# EAGLE design Ver3 (EAGLE 4.16)
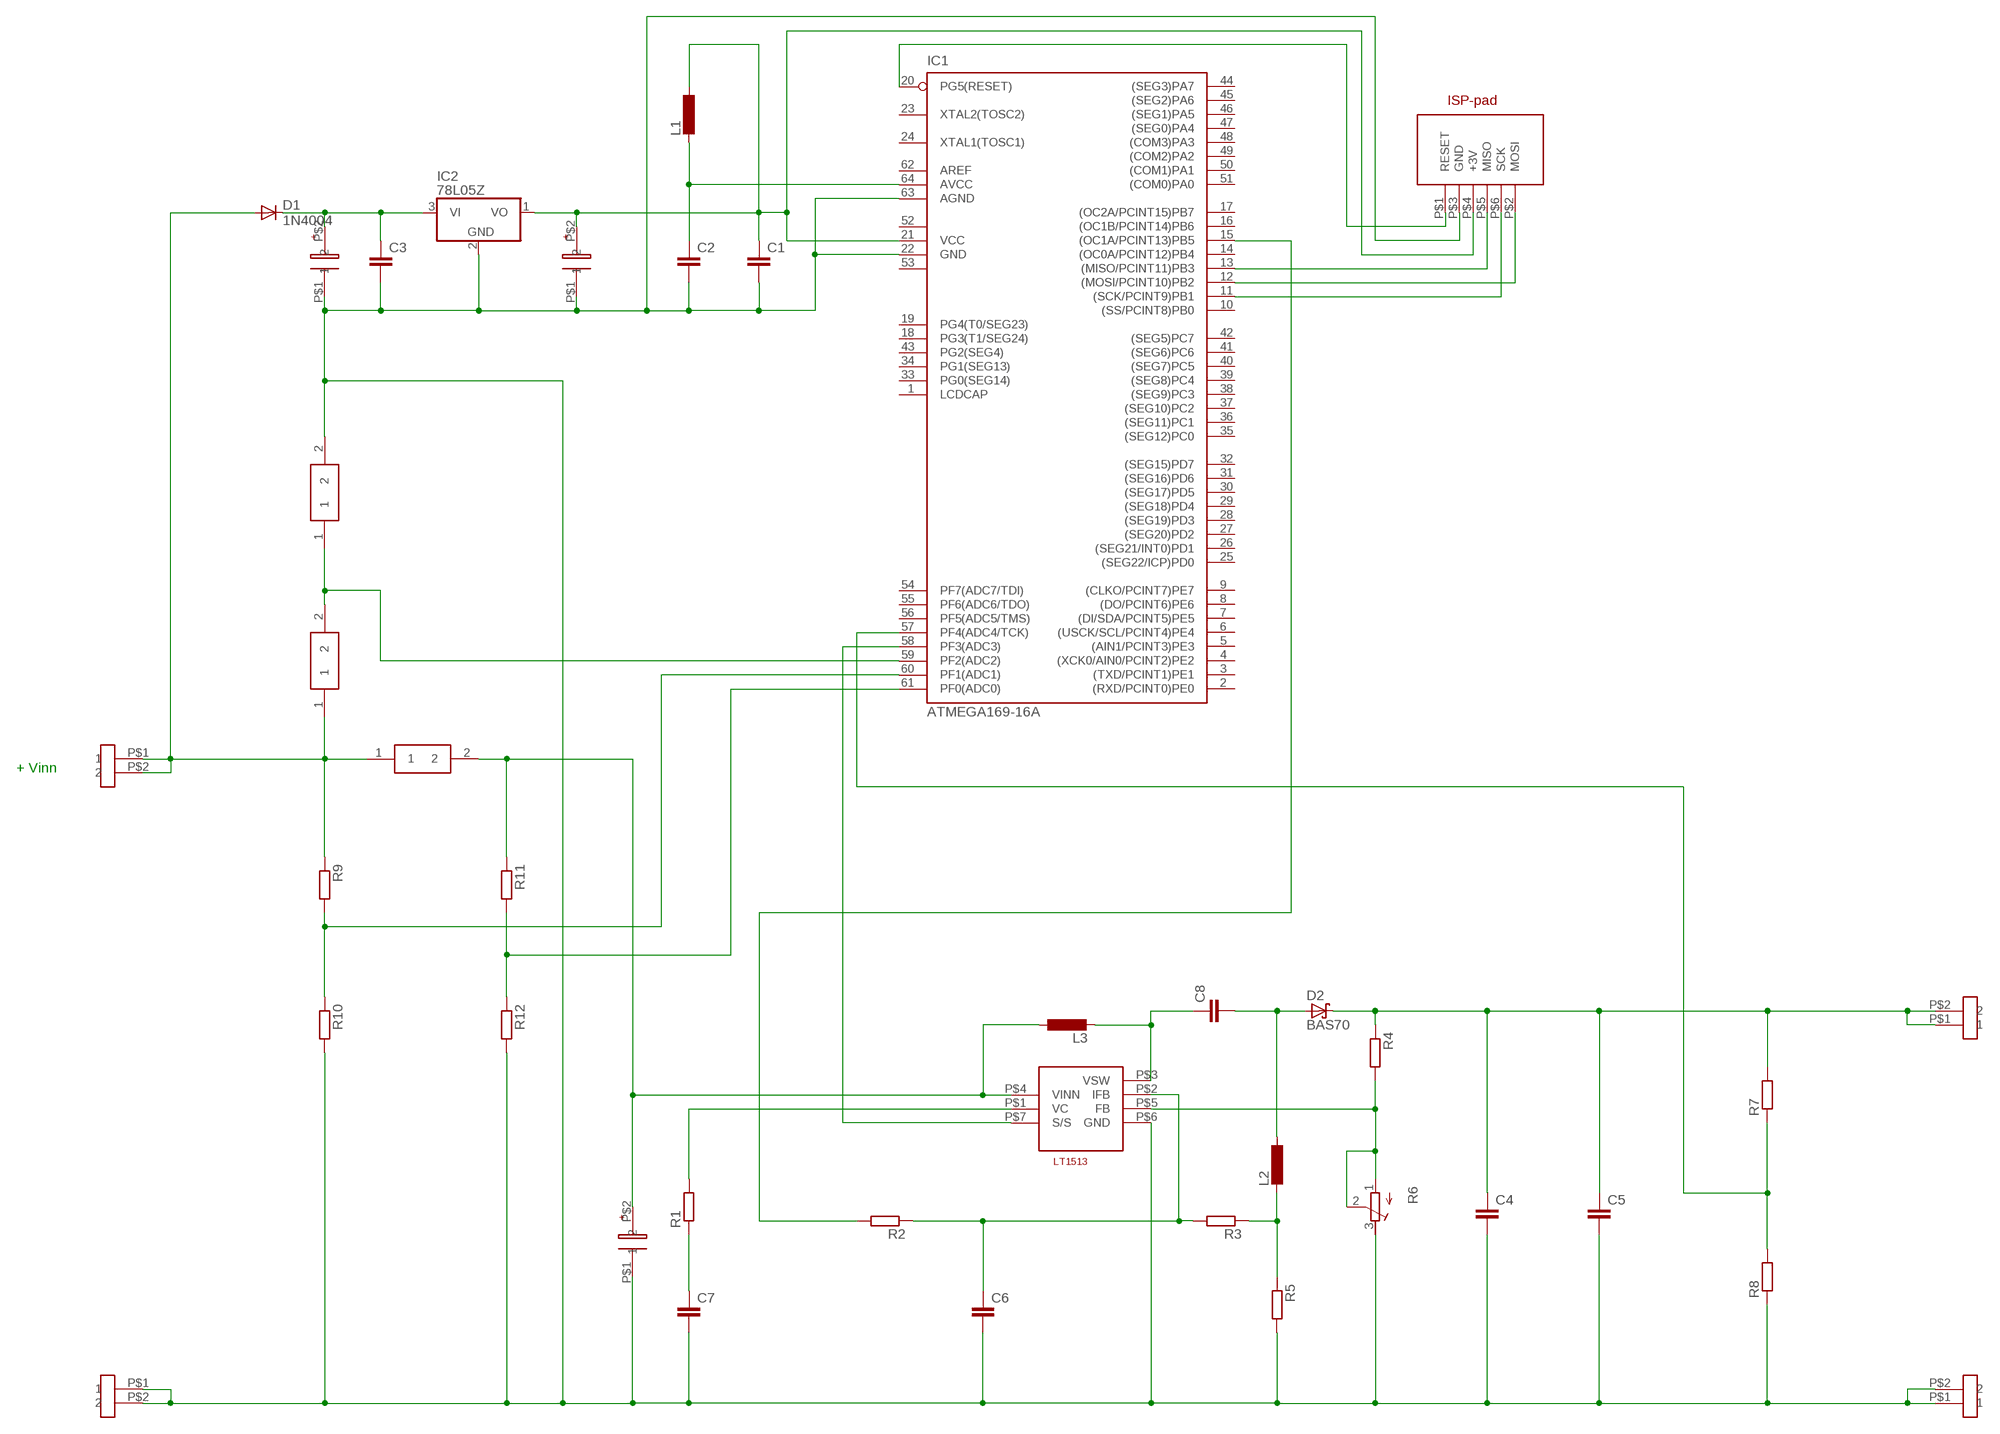
[diagram p0: schematic, sheet 1]

## Parts
68K1  MOTSTAND_OM  [MOTSTAND_OM]
68K2  MOTSTAND_OM  [MOTSTAND_OM]
68K3  MOTSTAND_OM  [MOTSTAND_OM]
100N1  CAP_OM  [CAP]
100N2  CAP_OM  [CAP]
100N3  CAP_OM  [CAP]
C1  C-EUC0603  [C0603]
C2  C-EUC0603  [C0603]
C3  C-EUC0603  [C0603]
C4  C-EUC0603  [C0603]
C5  C-EUC0603  [C0603]
C6  C-EUC0603  [C0603]
C7  C-EUC0603  [C0603]
C8  C-EUC0603  [C0603]
D1  1N4004  [DO41-10]
D2  BAS70  [SOT23]
IC1  ATMEGA169-16A  [TQFP64]
IC2  78L05Z  [TO92]
L1  L-EUL1812  [L1812]
L2  L-EU0204/7  [0204/7]
L3  L-EU0204/7  [0204/7]
R1  R-EU_R0603  [R0603]
R2  R-EU_R0603  [R0603]
R3  R-EU_R0603  [R0603]
R4  R-EU_R0603  [R0603]
R5  R-EU_R0603  [R0603]
R6  R-TRIMM4G/J  [RTRIM4G/J]
R7  R-EU_R0603  [R0603]
R8  R-EU_R0603  [R0603]
R9  R-EU_R0603  [R0603]
R10  R-EU_R0603  [R0603]
R11  R-EU_R0603  [R0603]
R12  R-EU_R0603  [R0603]
U$1  SKRUSTIFT_OM  [SKRUSTIFT]
U$2  LT1513  [LT1513]
U$3  SKRUSTIFT_OM  [SKRUSTIFT]
U$4  SKRUSTIFT_OM  [SKRUSTIFT]
U$5  SKRUSTIFT_OM  [SKRUSTIFT]
U$6  ISP_PAD_OM  [ISP_PAD]

## Nets
N$1: C2.1 IC1.64(AVCC) L1.2
N$2: 100N2.P$2 C1.1 IC1.21(VCC) IC2.1(VO) L1.1 U$6.P$4(+3V)
N$3: 68K3.2 100N1.P$1 100N2.P$1 100N3.P$1 C1.2 C2.2 C3.2 C4.2 C5.2 C6.2 C7.2 IC1.22(GND) IC1.63(AGND) IC2.2(GND) R5.2 R6.3(A) R8.1 R10.2 R12.2 U$2.P$6(GND) U$3.P$1 U$3.P$2 U$5.P$1 U$5.P$2 U$6.P$3(GND)
N$4: 100N1.P$2 C3.1 D1.C IC2.3(VI)
N$5: 68K1.1 68K2.1 D1.A R9.1 U$1.P$1 U$1.P$2
N$6: IC1.13((MISO/PCINT11)PB3) U$6.P$5(MISO)
N$7: 68K2.2 68K3.1 IC1.59(PF2(ADC2))
N$8: R1.2 U$2.P$1(VC)
N$9: IC1.12((MOSI/PCINT10)PB2) U$6.P$2(MOSI)
N$10: L2.2 R3.1 R5.1
N$11: IC1.15((OC1A/PCINT13)PB5) R2.2
N$12: C7.1 R1.1
N$13: C8.1 L3.2 U$2.P$3(VSW)
N$14: C4.1 C5.1 D2.3(C) R4.1 R7.2 U$4.P$1 U$4.P$2
N$15: R4.2 R6.1(E) R6.2(S) U$2.P$5(FB)
N$16: IC1.60(PF1(ADC1)) R9.2 R10.1
N$17: C8.2 D2.1(A) L2.1
N$18: C6.1 R2.1 R3.2 U$2.P$2(IFB)
N$19: IC1.58(PF3(ADC3)) U$2.P$7(S/S)
N$20: IC1.61(PF0(ADC0)) R11.2 R12.1
N$21: IC1.57(PF4(ADC4/TCK)) R7.1 R8.2
N$22: 68K1.2 100N3.P$2 L3.1 R11.1 U$2.P$4(VINN)
N$23: IC1.11((SCK/PCINT9)PB1) U$6.P$6(SCK)
N$25: IC1.20(PG5(RESET)) U$6.P$1(RESET)
Unconnected: IC1.1(LCDCAP) IC1.2((RXD/PCINT0)PE0) IC1.3((TXD/PCINT1)PE1) IC1.4((XCK0/AIN0/PCINT2)PE2) IC1.5((AIN1/PCINT3)PE3) IC1.6((USCK/SCL/PCINT4)PE4) IC1.7((DI/SDA/PCINT5)PE5) IC1.8((DO/PCINT6)PE6) IC1.9((CLKO/PCINT7)PE7) IC1.10((SS/PCINT8)PB0) IC1.14((OC0A/PCINT12)PB4) IC1.16((OC1B/PCINT14)PB6) IC1.17((OC2A/PCINT15)PB7) IC1.18(PG3(T1/SEG24)) IC1.19(PG4(T0/SEG23)) IC1.23(XTAL2(TOSC2)) IC1.24(XTAL1(TOSC1)) IC1.25((SEG22/ICP)PD0) IC1.26((SEG21/INT0)PD1) IC1.27((SEG20)PD2) IC1.28((SEG19)PD3) IC1.29((SEG18)PD4) IC1.30((SEG17)PD5) IC1.31((SEG16)PD6) IC1.32((SEG15)PD7) IC1.33(PG0(SEG14)) IC1.34(PG1(SEG13)) IC1.35((SEG12)PC0) IC1.36((SEG11)PC1) IC1.37((SEG10)PC2) IC1.38((SEG9)PC3) IC1.39((SEG8)PC4) IC1.40((SEG7)PC5) IC1.41((SEG6)PC6) IC1.42((SEG5)PC7) IC1.43(PG2(SEG4)) IC1.44((SEG3)PA7) IC1.45((SEG2)PA6) IC1.46((SEG1)PA5) IC1.47((SEG0)PA4) IC1.48((COM3)PA3) IC1.49((COM2)PA2) IC1.50((COM1)PA1) IC1.51((COM0)PA0) IC1.54(PF7(ADC7/TDI)) IC1.55(PF6(ADC6/TDO)) IC1.56(PF5(ADC5/TMS)) IC1.62(AREF)

## Notes on the sheet
- + Vinn

## Power pins joined to a net without a drawn wire
GND1: IC1.53(GND1)
VCC1: IC1.52(VCC1)

## Library data of the parts
68K1-68K3 = EGNE:MOTSTAND_OM
100N1-100N3 = EGNE:CAP_OM
C1-C8 = rcl:C-EU: CAPACITOR, European symbol
D1 = diode:1N4004: DIODE general purpose rectifier, 1 A
D2 = diode:BAS70: Silicon Schottky Diodes General-purpose diode for high-speed switching
IC1 = avr:ATMEGA169: MICROCONTROLLER 16 Kbytes FLASH 1 Kbytes SRAM 512 bytes EEPROM USART 8-channel 10 bit ADC 4x25 Segment LCD Driver
IC2 = linear:78*: Positive VOLTAGE REGULATOR Source: http://cache.national.com/ds/LM/LM78L05.pdf http://www.fairchildsemi.com/ds/LM/LM7805.pdf
L1-L3 = rcl:L-EU: INDUCTOR, European symbol
R1-R5 R7-R12 = rcl:R-EU_: RESISTOR, European symbol
R6 = rcl:R-TRIMM: Trimm resistor
U$1 U$3-U$5 = EGNE:SKRUSTIFT_OM
U$2 = EGNE:LT1513
U$6 = EGNE:ISP_PAD_OM

## Board
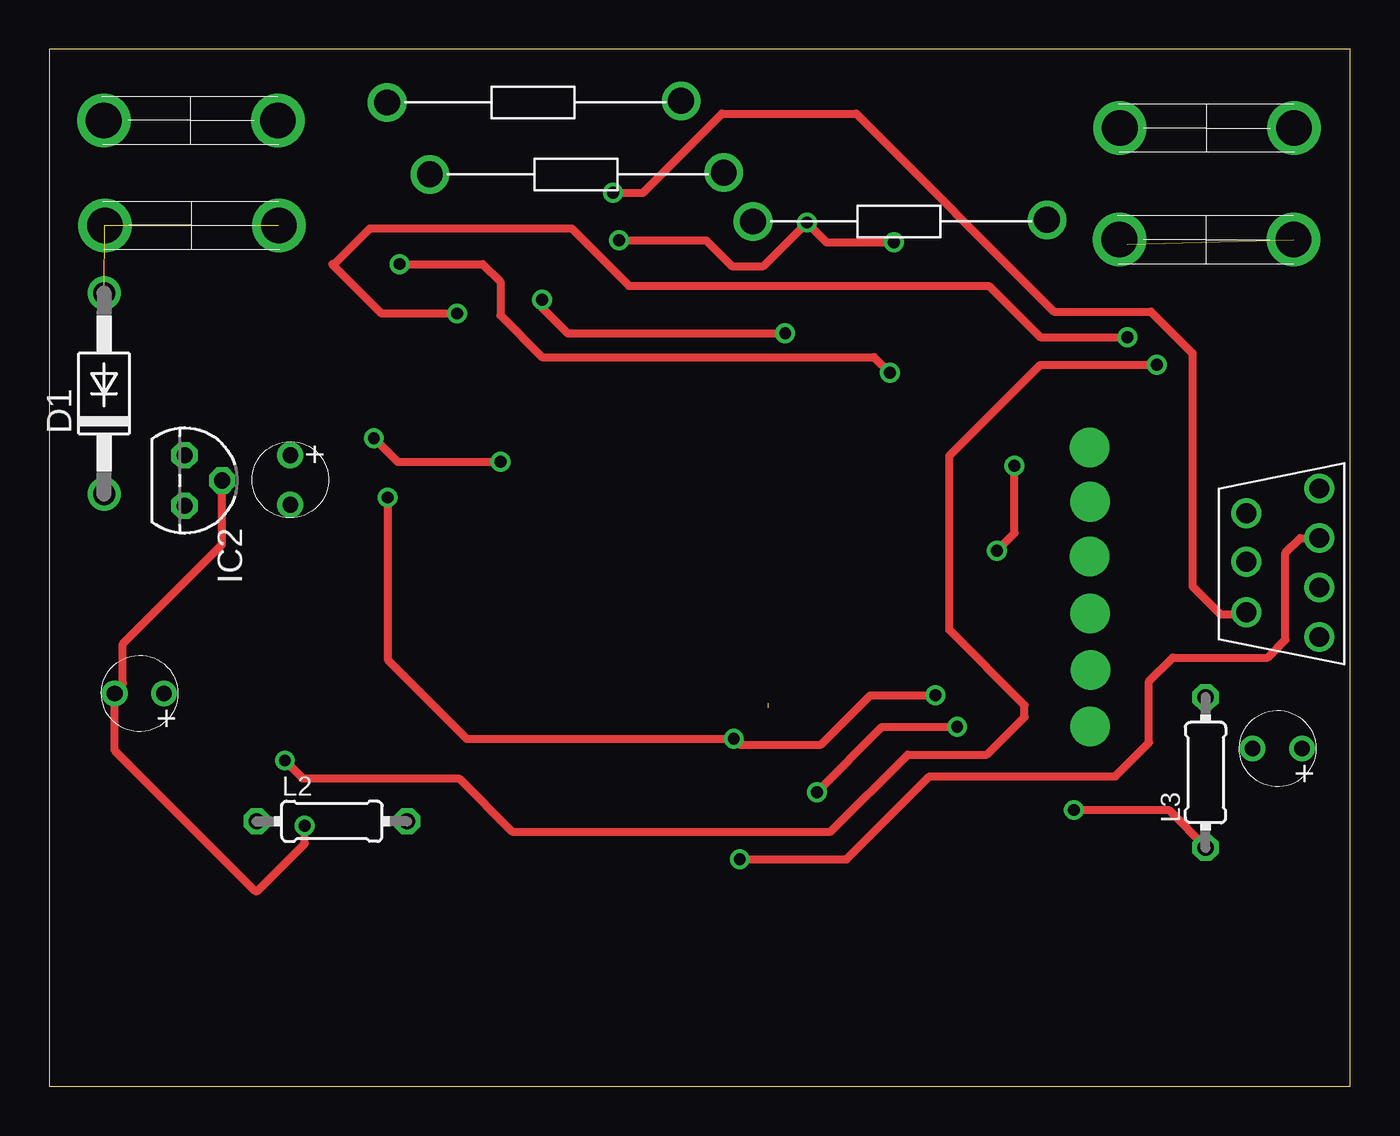
[diagram p1: board, top side]
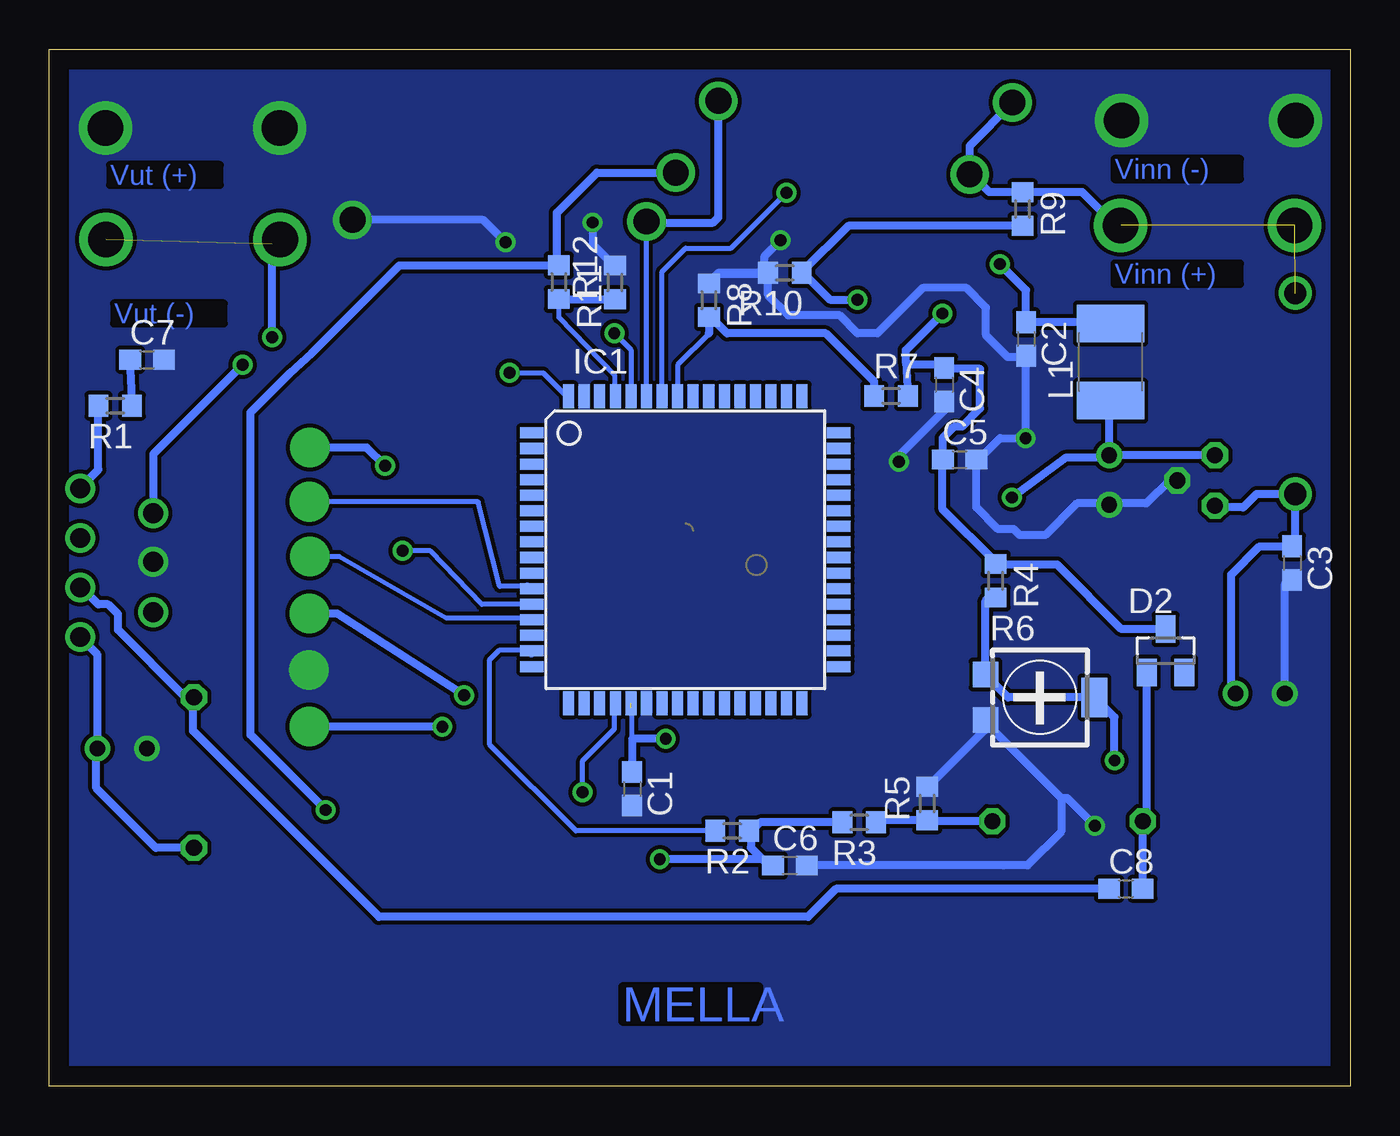
[diagram p2: board, bottom side, seen from below]

Size 65.78 x 52.41 mm. Coordinates in mm from the lower left corner, seen from the top.
Outline: 0,0 65.78,0 65.78,52.41 0,52.41 0,0
Copper layers (1*16): Top 0.035mm / dielectric 1.5mm / Bottom 0.035mm
Design rules "default": minimum track width 10mil, minimum drill 24mil, track to track 8mil, track to pad 8mil, pad to pad 8mil, via to via 8mil, smd to smd 8mil, copper to edge 40mil, drill to drill 8mil, minimum pad ring 10mil, minimum via ring 8mil, stop-mask expansion 4mil, vias tented up to drill 0mil, thermal gap 10mil

### Footprints (pad centres in the part's own frame; a part is rotated, then mirrored left to right if it is on the bottom)
MOTSTAND_OM = drill 1.3 round: 1 0,0; 2 -0.084,14.868
CAP = drill 0.8 round: P$1 0,0; P$2 0,2.5
C0603 = smd 1.1 x 1: 1 -0.85,0; 2 0.85,0
DO41-10 = drill 1.118 round: A 5.08,0; C -5.08,0
SOT23 = smd 1 x 1.4: 1 -0.95,-1.1; 2 0.95,-1.1; 3 0,1.1
TQFP64 = smd 1.194 x 0.559: 1 -7.76,5.905; 2 -7.76,5.118; 3 -7.76,4.331; 4 -7.76,3.543; 5 -7.76,2.756; 6 -7.76,1.968; 7 -7.76,1.181; 8 -7.76,0.394; 9 -7.76,-0.394; 10 -7.76,-1.181; 11 -7.76,-1.968; 12 -7.76,-2.756; 13 -7.76,-3.543; 14 -7.76,-4.331; 15 -7.76,-5.118; 16 -7.76,-5.905; 33 7.76,-5.905; 34 7.76,-5.118; 35 7.76,-4.331; 36 7.76,-3.543; 37 7.76,-2.756; 38 7.76,-1.968; 39 7.76,-1.181; 40 7.76,-0.394; 41 7.76,0.394; 42 7.76,1.181; 43 7.76,1.968; 44 7.76,2.756; 45 7.76,3.543; 46 7.76,4.331; 47 7.76,5.118; 48 7.76,5.905 | smd 0.559 x 1.194: 17 -5.905,-7.76; 18 -5.118,-7.76; 19 -4.331,-7.76; 20 -3.543,-7.76; 21 -2.756,-7.76; 22 -1.968,-7.76; 23 -1.181,-7.76; 24 -0.394,-7.76; 25 0.394,-7.76; 26 1.181,-7.76; 27 1.968,-7.76; 28 2.756,-7.76; 29 3.543,-7.76; 30 4.331,-7.76; 31 5.118,-7.76; 32 5.905,-7.76; 49 5.905,7.76; 50 5.118,7.76; 51 4.331,7.76; 52 3.543,7.76; 53 2.756,7.76; 54 1.968,7.76; 55 1.181,7.76; 56 0.394,7.76; 57 -0.394,7.76; 58 -1.181,7.76; 59 -1.968,7.76; 60 -2.756,7.76; 61 -3.543,7.76; 62 -4.331,7.76; 63 -5.118,7.76; 64 -5.905,7.76
TO92 = drill 0.813 octagon: 1 -1.27,0; 2 0,1.905; 3 1.27,0
L1812 = smd 1.9 x 3.4: 1 -1.95,0; 2 1.95,0
0204/7 = drill 0.813 octagon: 1 -3.81,0; 2 3.81,0
R0603 = smd 1 x 1.1: 1 -0.85,0; 2 0.85,0
RTRIM4G/J = smd 1.3 x 1.3: 1 -1.15,-2.75; 3 1.15,-2.75 | smd 2 x 1.3: 2 0,2.75
SKRUSTIFT = drill 1.8 round: P$1 0,8.8; P$2 0,0
LT1513 = drill 1 round: P$1 0,0; P$2 2.5,0; P$3 5,0; P$4 7.5,0; P$5 1.25,-3.7; P$6 3.7,-3.7; P$7 6.25,-3.7
ISP_PAD = drill 0 pad 2 round: P$1 0,0; P$2 14.099,0.023; P$3 2.846,-0.029; P$4 5.711,-0.01; P$5 8.591,0.015; P$6 11.362,-0.011

### Placement (x,y rotation side)
68K1  19.24,46.1 270 top
68K2  17.08,49.73 270 top
68K3  35.58,43.71 270 top
100N1  3.29,19.85 270 top
100N2  12.18,29.39 0 top
100N3  60.85,17.07 270 top
C1  36.31,15.03 270 bottom
C2  16.39,37.77 270 bottom
C3  2.93,26.44 270 bottom
C4  20.53,35.46 270 bottom
C5  19.74,31.68 0 bottom
C6  28.33,11.16 0 bottom
C7  60.84,36.72 0 bottom
C8  11.34,9.98 0 bottom
D1  2.76,35.02 90 top
D2  9.33,22.01 0 bottom
IC1  33.62,27.12 0 bottom
IC2  6.83,30.62 270 top
L1  12.11,36.6 90 bottom
L2  14.29,13.39 0 top
L3  58.47,15.86 90 top
R1  62.45,34.4 180 bottom
R2  31.25,12.91 180 bottom
R3  24.83,13.34 180 bottom
R4  17.92,25.55 270 bottom
R5  21.39,14.29 90 bottom
R6  15.69,19.66 270 bottom
R7  23.22,34.89 0 bottom
R8  32.42,39.73 270 bottom
R9  16.56,44.34 270 bottom
R10  28.58,41.12 180 bottom
R11  40.02,40.65 270 bottom
R12  37.18,40.64 90 bottom
U$1  11.6,43.51 90 top
U$2  64.23,30.21 270 top
U$3  11.55,48.83 90 top
U$4  62.91,42.79 90 top
U$5  62.94,48.44 90 top
U$6  52.63,18.18 90 top

### Tracks (layer width: path | path; a pad name or v marks a point on that pad's centre or on a via)
N$1  (via drill 0.6)
  Top 0.406: v17.71,41.56 21.91,41.56 22.81,40.66 22.81,38.96 24.91,36.86 41.71,36.86 v42.51,36.06
  Bottom 0.254: v42.51,36.06 40.81,36.06 39.61,34.86
  Bottom 0.406: 12.11,38.66 | L1.2 12.11,38.66 | 12.11,38.66 12.15,38.63 C2.1 16.39,40.24 v17.71,41.56 | 39.61,34.86 39.59,34.88 IC1.64
N$2  (via drill 0.6)  (1 unrouted)
  Top 0.406: v17.11,29.76 17.11,21.56 21.11,17.56 v34.61,17.56 34.91,17.26 39.01,17.26 41.51,19.76 v44.81,19.76
  Bottom 0.254: 36.31,17.46 36.31,19.06
  Bottom 0.406: 12.18,31.79 12.21,31.76 14.41,31.76 v17.11,29.76 | 12.18,31.79 100N2.P$2 12.18,34.44 12.31,34.56 12.22,34.66 L1.1 | IC2.1 12.08,31.89 12.18,31.79 | 36.37,19.13 36.31,19.06 | C1.1 36.31,17.46 36.21,17.56 | v34.61,17.56 36.21,17.56 | 36.21,17.56 36.31,17.56 | U$6.P$4 51.24,23.89 v44.81,19.76
N$3  (via drill 0.6)
  Top 0.406: v12.91,13.16 12.91,12.26 10.51,9.86 10.41,9.86 3.31,16.96 3.31,19.66 3.12,19.85 | 3.12,19.85 3.11,19.86 | 3.12,19.85 100N1.P$1 3.22,19.85 3.21,19.86 3.71,20.36 3.71,22.36 8.74,27.39 IC2.2 | v22.81,31.56 17.61,31.56 v16.41,32.76 | v42.71,42.66 39.31,42.66 v38.31,43.66 36.11,41.46 34.51,41.46 33.21,42.76 v28.81,42.76
  Bottom 0.406: IC2.2 9.15,30.62 10.31,29.46 v12.21,29.46 | v12.21,29.46 12.18,29.44 100N2.P$1 | C6.2 17.52,11.16 17.51,11.16 16.31,11.16 14.61,12.86 14.61,14.56 | 18.51,18.46 18.46,18.51 R6.3 | 14.61,14.56 18.51,18.46 | 21.39,15.08 21.41,15.06 | 21.39,15.08 R5.2 | 18.51,18.46 18.51,17.96 21.39,15.08 | 14.61,14.56 14.31,14.56 v12.91,13.16 | 2.93,25.74 2.91,25.76 | 2.93,25.74 C3.2 | 100N1.P$1 3.29,25.38 2.93,25.74 | v12.21,29.46 13.81,29.46 15.41,27.86 16.71,27.86 17.01,28.16 17.81,28.16 18.91,29.26 18.91,31.56 18.81,31.66 18.82,31.68 C5.2 18.89,31.58 | C4.2 20.53,34.14 22.81,31.86 v22.81,31.56 | 18.89,31.58 19.01,31.46 | 18.89,31.58 17.71,32.76 v16.41,32.76 16.39,32.79 C2.2 16.35,36.93 | 32.42,40.65 R8.1 | 32.42,40.65 31.95,41.12 R10.2 29.43,39.99 28.41,38.96 25.81,38.96 24.91,38.06 23.91,38.06 21.61,40.36 19.41,40.36 18.41,39.36 18.41,37.96 17.31,36.86 16.41,36.86 16.35,36.93 | 16.35,36.93 16.31,36.96 | 68K3.2 43.85,43.8 v42.71,42.66 | R12.2 37.21,41.46 38.31,42.56 v38.31,43.66 | 32.42,40.65 32.32,40.65 31.91,41.06 29.91,41.06 29.61,41.36 29.61,41.96 v28.81,42.76
  pour Bottom (no thermals): 0.31,52.06 65.41,52.06 65.41,51.36 65.41,0.26 0.31,0.26
N$4
  Bottom 0.406: IC2.3 6.8,29.35 6.71,29.26 5.41,29.26 4.74,29.94 D1.C 2.76,27.61 2.93,27.44 C3.1 4.58,27.29 6.01,25.86 6.01,20.06 5.8,19.85 100N1.P$2
N$5  (2 unrouted)
  Bottom 0.406: U$1.P$2 11.76,43.51 11.81,43.46 13.54,45.19 R9.1 18.24,45.19 19.21,46.16 19.24,46.14 68K1.1 19.24,47.54 17.04,49.73 | 17.04,49.73 17.01,49.76 | 17.04,49.73 68K2.1
N$6
  Bottom 0.254: U$6.P$5 51.12,26.77 45.71,23.66 41.61,23.66
  Bottom 0.406: IC1.13 41.5,23.58 41.51,23.56 41.61,23.66
N$7
  Bottom 0.254: 35.58,35.19 68K3.1
  Bottom 0.406: 68K2.2 31.95,43.93 32.21,43.66 35.41,43.66 35.46,43.71 68K3.1 | IC1.59 35.59,35.14 35.61,35.16 35.58,35.19
N$8
  Bottom 0.406: 64.26,30.21 64.31,30.16 | 64.26,30.21 U$2.P$1 | R1.2 63.3,31.17 64.26,30.21
N$9  (via drill 0.6)
  Top 0.406: v48.81,31.36 48.81,27.96 v47.91,27.06
  Bottom 0.254: v47.91,27.06 46.51,27.06 43.91,24.36 41.51,24.36
  Bottom 0.406: U$6.P$2 49.73,32.28 v48.81,31.36 | 41.51,24.36 41.41,24.36 IC1.12
N$10
  Bottom 0.406: 21.39,13.18 21.41,13.16 | 21.39,13.18 R5.1 23.73,13.44 23.83,13.34 R3.1 | L2.2 21.18,13.39 21.39,13.18
N$11
  Bottom 0.254: R2.2 39.16,12.91 43.51,17.26 43.51,21.56 43.01,22.06 41.61,22.06
  Bottom 0.406: IC1.15 41.38,21.9 41.41,21.86 41.61,22.06
N$12
  Bottom 0.406: R1.1 61.67,34.4 61.71,34.36 61.57,34.22 C7.1
N$13
  Bottom 0.406: C8.1 26,9.98 27.41,8.56 49.11,8.56 58.51,17.96 58.51,19.56 58.47,19.6 L3.2 58.91,19.67 62.31,23.06 62.31,23.86 62.81,24.36 63.31,24.36 64.16,25.21 U$2.P$3
N$14  (via drill 0.6)  (1 unrouted)
  Top 0.406: v20.61,39.06 16.81,39.06 14.31,41.56 14.41,41.56 16.21,43.36 26.41,43.36 29.31,40.46 47.51,40.46 50.11,37.86 v54.51,37.86
  Bottom 0.406: D2.3 11.56,23.11 14.81,26.36 17.71,26.36 17.81,26.26 17.92,26.38 R4.1 17.92,26.48 20.61,29.16 20.61,31.56 20.51,31.66 20.52,31.68 C5.1 20.59,32.78 20.01,33.36 19.61,33.36 18.71,34.26 18.71,36.26 20.31,36.26 20.51,36.46 | 20.51,36.46 20.53,36.44 C4.1 | 22.47,36.62 R7.2 | 20.51,36.46 22.31,36.46 22.47,36.62 | 22.47,36.62 22.47,37.21 v20.61,39.06 | U$4.P$1 54.14,42.8 54.21,42.86 54.51,42.56 v54.51,37.86
N$15  (via drill 0.6)
  Top 0.406: v56.01,36.46 50.11,36.46 45.51,31.86 45.51,23.06 49.31,19.26 49.31,18.66 47.41,16.76 43.41,16.76 39.51,12.86 23.41,12.86 20.71,15.56 12.81,15.56 v11.91,16.46
  Bottom 0.406: R4.2 17.92,24.88 18.01,24.96 18.44,24.54 R6.1 18.44,20.79 17.3,19.66 R6.2 12.92,19.66 12.91,19.66 11.91,18.66 v11.91,16.46 | U$2.P$5 60.52,31.95 v56.01,36.46
N$16  (via drill 0.6)
  Top 0.406: v37.21,38.06 26.21,38.06 24.91,39.36 v24.91,39.76
  Bottom 0.254: IC1.60 36.37,37.23 v37.21,38.06
  Bottom 0.406: 27.75,41.12 27.81,41.06 | 27.75,41.12 R10.1 27.73,41.14 27.71,41.16 | R9.2 25.38,43.49 27.71,41.16 | 27.71,41.16 27.75,41.12 | v24.91,39.76 26.31,39.76 27.71,41.16
N$17
  Bottom 0.406: 10.47,13.3 10.51,13.26 | 10.47,13.3 L2.1 10.47,9.93 | D2.1 10.28,13.49 10.47,13.3 | 10.47,9.93 10.49,9.94 C8.2 | 10.47,9.93 10.41,9.86
N$18  (via drill 0.6)
  Top 0.406: U$2.P$2 63.26,27.71 62.51,26.96 62.51,22.56 61.61,21.66 56.81,21.66 55.61,20.46 55.61,17.36 53.91,15.66 44.51,15.66 40.31,11.46 v34.91,11.46
  Bottom 0.406: 30.31,12.86 30.35,12.91 R2.1 | R3.2 29.83,13.34 30.31,12.86 | 30.31,12.86 30.31,12.06 29.41,11.16 | 29.41,11.16 C6.1 | v34.91,11.46 29.71,11.46 29.41,11.16
N$19  (via drill 0.6)
  Top 0.406: v28.51,45.16 30.01,45.16 34.01,49.16 40.81,49.16 50.81,39.16 55.71,39.16 57.81,37.06 57.81,25.26 59.21,23.86 60.51,23.86 60.52,23.88 U$2.P$7
  Bottom 0.254: IC1.58 34.8,41.17 33.61,42.36 31.31,42.36 v28.51,45.16
N$20
  Bottom 0.254: 37.18,34.99 37.18,35.93 40.01,38.86 40.01,39.96
  Bottom 0.406: 37.19,34.78 37.11,34.86 | IC1.61 37.19,34.78 | 37.19,34.78 37.18,34.99 | 40.18,39.79 40.17,39.8 R11.2 40.02,39.96 40.01,39.96 | 40.18,39.79 R12.1 | 40.18,39.79 40.21,39.76
N$21
  Bottom 0.254: 32.42,38.05 34.01,36.46 34.01,35.06
  Bottom 0.406: R7.1 24.07,35.62 26.51,38.06 31.51,38.06 32.33,38.88 R8.2 32.42,38.05 | IC1.57 34.03,34.88 34.11,34.96 34.01,35.06
N$22  (via drill 0.6)
  Top 0.406: L3.1 58.49,12.05 58.51,12.06 56.61,13.96 v51.81,13.96
  Bottom 0.406: L3.1 60.4,12.05 63.41,15.06 63.41,16.96 63.52,17.07 | 63.52,17.07 63.61,17.16 | 63.52,17.07 100N3.P$2 63.35,21.8 64.23,22.68 U$2.P$4 | 68K1.2 38.09,46.18 40.11,44.16 40.11,41.66 40.01,41.56 40.02,41.56 R11.1 48.07,41.5 52.51,37.06 53.61,36.06 55.61,34.06 55.61,17.76 v51.81,13.96
N$23
  Bottom 0.254: U$6.P$6 44.09,29.54 43.01,25.26 41.61,25.26
  Bottom 0.406: IC1.11 41.38,25.1 41.41,25.06 41.61,25.26
N$25  (via drill 0.6)
  Top 0.406: v45.91,18.16 42.11,18.16 v38.81,14.86
  Bottom 0.254: v38.81,14.86 38.81,16.46 37.21,18.06 37.21,19.16
  Bottom 0.406: U$6.P$1 45.93,18.18 v45.91,18.16 | IC1.20 37.16,19.31 37.11,19.26 37.21,19.16

### Text on the board
Bottom: Vinn (-) | Vut (+) | Vinn (+) | Vut (-) | MELLA